# EAGLE board main (EAGLE 5.01), part 1 of 2
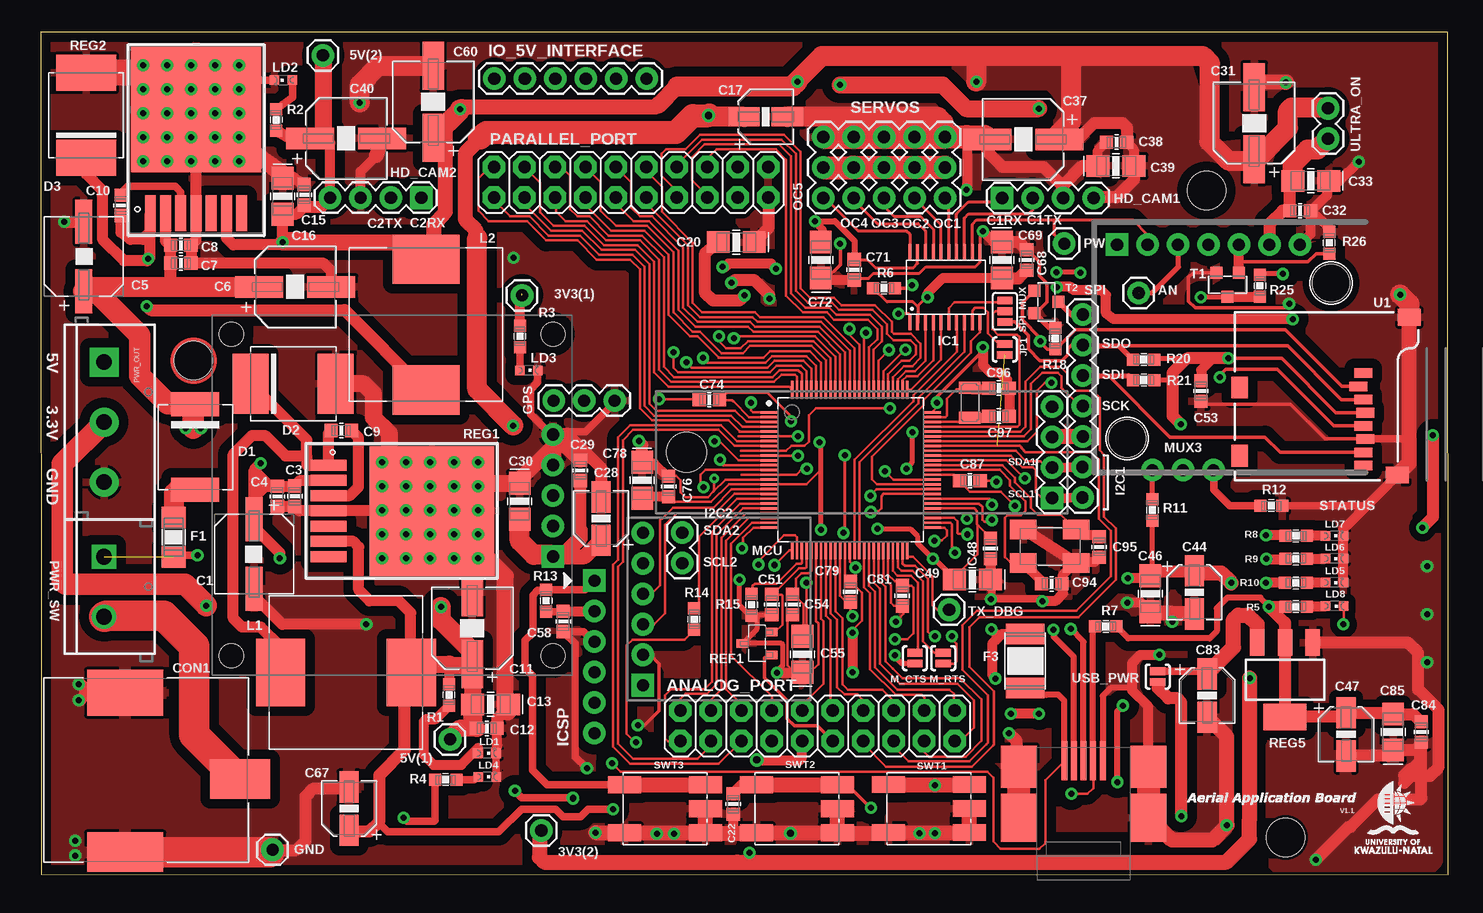
[diagram p2: board, top side]
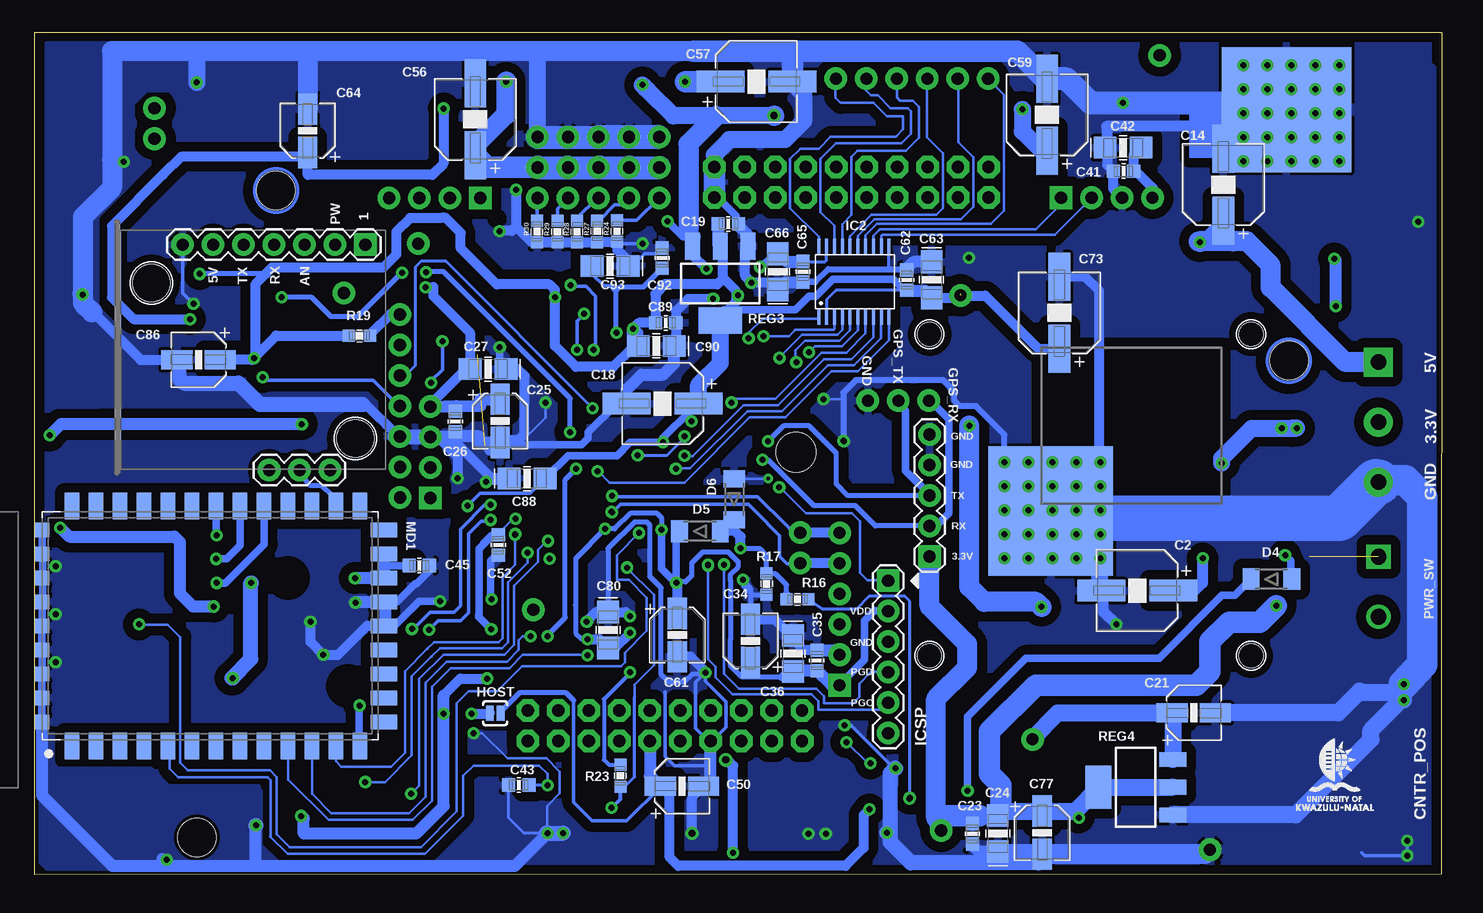
[diagram p3: board, bottom side, seen from below]

Size 117.33 x 70.2 mm. Coordinates in mm from the lower left corner, seen from the top.
Outline: 0.04,0.01 117.33,0 117.29,70.19 0,70.2 0.04,0.01
Copper layers (1*16): Top 0.035mm / dielectric 1.5mm / Bottom 0.035mm
Design rules "SparkFun *": minimum track width 8mil, minimum drill 20mil, track to track 0.2mm, track to pad 0.2mm, pad to pad 0.19mm, via to via 0.2mm, smd to smd 0.2mm, copper to edge 10mil, drill to drill 8mil, minimum pad ring 12mil, minimum via ring 10mil, stop-mask expansion 4mil, vias tented up to drill 25mil, thermal gap 10mil
Holes 3.2 mm at 103.8,3.08 97.19,57.01 12.76,42.83

## Footprints (pad centres in the part's own frame; a part is rotated, then mirrored left to right if it is on the bottom)
1X01 = drill 1.016 pad 1.88: 1 0,0
2X10 = drill 1.016 pad 1.88 octagon: 1 -11.43,-1.27; 2 -11.43,1.27; 3 -8.89,-1.27; 4 -8.89,1.27; 5 -6.35,-1.27; 6 -6.35,1.27; 7 -3.81,-1.27; 8 -3.81,1.27; 9 -1.27,-1.27; 10 -1.27,1.27; 11 1.27,-1.27; 12 1.27,1.27; 13 3.81,-1.27; 14 3.81,1.27; 15 6.35,-1.27; 16 6.35,1.27; 17 8.89,-1.27; 18 8.89,1.27; 19 11.43,-1.27; 20 11.43,1.27
NAZT150M50V6.3X6.3NBF = smd 3.65 x 1.4: + -2.91,-0.06; - 2.89,-0.06
6.3X5.5 = smd 4 x 1.8: + -3,0; - 3,0
0603 = smd 1.1 x 1.1: 1 -0.86,0; 2 0.84,0
EIA3216-18 = smd 1.9 x 1.8: A 1.5,0; C -1.5,0
4X6.3 = smd 2.6 x 1.6: A 1.8,0; C -1.8,0
POWERJACK = smd 5 x 3.3: P$1 -7.85,0.76 | smd 6.35 x 3.81: P$2 1.75,-6.43 | smd 6.35 x 3.3: P$3 1.75,6.86
DO-214AB(SMC) = smd 2 x 4: A 7.11,-3.11; C 0,-3.11
SMC = smd 3 x 5: A -3.5,0; C 3.59,0
MELF-MLL34 = smd 1.4 x 1.8: 1 -1.7,0; 2 1.7,0
3413.0223.22 = smd 1.8 x 2: 1 -1.65,0; 2 1.65,0
MF-MSMF020-2 = smd 1.7 x 3.2: 1 -2.2,0; 2 2.3,0
1X03 = drill 1.016 pad 1.88: 1 0,0; 2 2.54,0; 3 5.08,0
SENSOR_STICK = drill 1.016 pad 1.88 square: 1 -16.51,3.81 | drill 1.016 pad 1.88: 2 -16.51,1.27; 3 -16.51,-1.27; 4 -16.51,-3.81 | hole 3.302: 13.97,0
LS20031 = drill 1.016 pad 1.88 square: 1 9.885,1.6 | drill 1.016 pad 1.88: 2 12.425,1.6; 3 14.965,1.6; 4 17.505,1.6; 5 20.045,1.6 | hole 2: 1.6,28.4; 28.4,28.4; 28.4,1.6; 1.6,1.6
EZ3 = drill 1.016 pad 1.88 square: 1 20.4,1.2 | drill 1.016 pad 1.88: 2 17.86,1.2; 3 15.32,1.2; 4 12.78,1.2; 5 10.24,1.2; 6 7.7,1.2; 7 5.16,1.2 | hole 3.1: 19.56,17.36; 2.56,4.4
BAROMETER = drill 1.016 pad 1.88 square: 1 -6.35,6.35 | drill 1.016 pad 1.88: 2 -3.81,6.35; 3 -1.27,6.35; 4 1.27,6.35; 5 3.81,6.35; 6 6.35,6.35
1X04 = drill 1.016 pad 1.88 square: 1 0,0 | drill 1.016 pad 1.88: 2 2.54,0; 3 5.08,0; 4 7.62,0
SJ_2S-NO = smd 0.635 x 1.27: 1 -0.45,0; 2 0.45,0
1X02 = drill 1.016 pad 1.88: 1 0,0; 2 2.54,0
U20-3 = smd 0.25 x 1.27: 1 -3.025,-3.1; 2 -2.375,-3.1; 3 -1.725,-3.1; 4 -1.075,-3.1; 5 -0.425,-3.1; 6 0.225,-3.1; 7 0.875,-3.1; 8 1.525,-3.1; 9 2.175,-3.1; 10 2.825,-3.1; 11 2.825,2.805; 12 2.175,2.805; 13 1.525,2.805; 14 0.875,2.805; 15 0.225,2.805; 16 -0.425,2.805; 17 -1.075,2.805; 18 -1.725,2.805; 19 -2.375,2.805; 20 -3.025,2.805
1X06 = drill 1.016 pad 1.88: 1 0,0; 2 2.54,0; 3 5.08,0; 4 7.62,0; 5 10.16,0; 6 12.7,0
12X12MM_PACK = smd 4.1 x 5.6: 1 -5.45,0; 2 5.45,0
CHIPLED_0603 = smd 0.8 x 0.8: A 0,-0.75; C 0,0.75
TQFP100_12MM = smd 1.5 x 0.2: 1 0,0; 2 0,-0.4; 3 0,-0.8; 4 0,-1.2; 5 0,-1.6; 6 0,-2; 7 0,-2.4; 8 0,-2.8; 9 0,-3.2; 10 0,-3.6; 11 0,-4; 12 0,-4.4; 13 0,-4.8; 14 0,-5.2; 15 0,-5.6; 16 0,-6; 17 0,-6.4; 18 0,-6.8; 19 0,-7.2; 20 0,-7.6; 21 0,-8; 22 0,-8.4; 23 0,-8.8; 24 0,-9.2; 25 0,-9.6; 51 13.55,-9.6; 52 13.55,-9.2; 53 13.55,-8.8; 54 13.55,-8.4; 55 13.55,-8; 56 13.55,-7.6; 57 13.55,-7.2; 58 13.55,-6.8; 59 13.55,-6.4; 60 13.55,-6; 61 13.55,-5.6; 62 13.55,-5.2; 63 13.55,-4.8; 64 13.55,-4.4; 65 13.55,-4; 66 13.55,-3.6; 67 13.55,-3.2; 68 13.55,-2.8; 69 13.55,-2.4; 70 13.55,-2; 71 13.55,-1.6; 72 13.55,-1.2; 73 13.55,-0.8; 74 13.55,-0.4; 75 13.55,0 | smd 0.2 x 1.5: 26 1.9,-11.5; 27 2.3,-11.5; 28 2.7,-11.5; 29 3.1,-11.5; 30 3.5,-11.5; 31 3.9,-11.5; 32 4.3,-11.5; 33 4.7,-11.5; 34 5.1,-11.5; 35 5.5,-11.5; 36 5.9,-11.5; 37 6.3,-11.5; 38 6.7,-11.5; 39 7.1,-11.5; 40 7.5,-11.5; 41 7.9,-11.5; 42 8.3,-11.5; 43 8.7,-11.5; 44 9.1,-11.5; 45 9.5,-11.5; 46 9.9,-11.5; 47 10.3,-11.5; 48 10.7,-11.5; 49 11.1,-11.5; 50 11.5,-11.5; 76 11.5,1.9; 77 11.1,1.9; 78 10.7,1.9; 79 10.3,1.9; 80 9.9,1.9; 81 9.5,1.9; 82 9.1,1.9; 83 8.7,1.9; 84 8.3,1.9; 85 7.9,1.9; 86 7.5,1.9; 87 7.1,1.9; 88 6.7,1.9; 89 6.3,1.9; 90 5.9,1.9; 91 5.5,1.9; 92 5.1,1.9; 93 4.7,1.9; 94 4.3,1.9; 95 3.9,1.9; 96 3.5,1.9; 97 3.1,1.9; 98 2.7,1.9; 99 2.3,1.9; 100 1.9,1.9
WIFIFLY2 = smd 2.2 x 1.2: 1 -2,25.5; 2 -2,23.5; 3 -2,21.5; 4 -2,19.5; 5 -2,17.5; 6 -2,15.5; 7 -2,13.5; 8 -2,11.5; 9 -2,9.5; 10 -2,7.5; 11 -2,5.5; 12 -2,3.5; 13 -2,1.5; 23 18,1.5; 24 18,3.5; 25 18,5.5; 26 18,7.5; 27 18,9.5; 28 18,11.5; 29 18,13.5; 30 18,15.5; 31 18,17.5; 32 18,19.5; 33 18,21.5; 34 18,23.5; 35 18,25.5 | smd 1.2 x 2.2: 14 0,-0.5; 15 2,-0.5; 16 4,-0.5; 17 6,-0.5; 18 8,-0.5; 19 10,-0.5; 20 12,-0.5; 21 14,-0.5; 22 16,-0.5 | smd 1.2 x 1.2: 36 16,28; 37 14,28; 38 12,28; 39 10,28; 40 8,28; 41 6,28; 42 4,28; 43 2,28; 44 0,28
SCREWTERMINAL-5MM-3 = drill 1.3 pad 2.413 square: 1 0,0 | drill 1.3 pad 2.413: 2 5,0; 3 10,0
SCREWTERMINAL-5MM-2 = drill 1.3 pad 2.032 square: 1 0,0 | drill 1.3 pad 2.032: 2 5,0
0603' = smd 1 x 1: 1 -0.9,0; 2 0.9,0
SOT-23-3 = smd 0.7 x 1: 1 -0.95,-1.9; 2 0.95,-1.9; 3 0,0.5
TO-263 = smd 3 x 0.91: 1 8.62,-3.81; 2 8.62,-2.54; 3 8.62,-1.27; 4 8.62,0; 5 8.62,1.27; 6 8.62,2.54; 7 8.62,3.81 | smd 10.41 x 10.8: 8 0,0 | smd 10.41 x 10.8 bottom: 9 0,0
SOT223 = smd 1.219 x 2.235: 1 -2.311,-3.099; 2 0,-3.099; 3 2.311,-3.099 | smd 3.6 x 2.2: 4 0,3.099
SERVO_HEADER = drill 1.016 pad 1.88: 1 -2.54,0; 2 0,0; 3 2.54,0; 4 -2.54,-2.54; 5 0,-2.54; 6 2.54,-2.54; 7 -2.54,-5.08; 8 0,-5.08; 9 2.54,-5.08; 10 -2.54,-7.62; 11 0,-7.62; 12 2.54,-7.62; 13 -2.54,-10.16; 14 0,-10.16; 15 2.54,-10.16
1X05 = drill 1.016 pad 1.88: 1 0,0; 2 2.54,0; 3 5.08,0; 4 7.62,0; 5 10.16,0
SJ_3 = smd 0.635 x 1.27: 1 -0.889,0; 2 0,0; 3 0.889,0
TACT = smd 2.75 x 1.4: 1 3.375,-2; 2 -3.375,-2; 3 3.375,2; 4 -3.375,2; 5 3.375,0
MOSFET = smd 1 x 1: 1 0.95,2; 2 -0.95,2; 3 0,0
MICRO-SD-SOCKET-PP = smd 0.8 x 1.5: 1 -8.94,10.7; 2 -7.84,10.3; 3 -6.74,10.7; 4 -5.64,10.9; 5 -4.54,10.7; 6 -3.44,10.9; 7 -2.34,10.7; 8 -1.24,10.7 | smd 1.8 x 1.4: CD1 -2.05,0.4; CD2 -7.75,0.4 | smd 1.4 x 1.9: GND1 -13.6,14.55; GND3 -0.45,13.55
ICSP = drill 1.016 pad 1.88 square: 1 -6.35,0 | drill 1.016 pad 1.88: 2 -3.81,0; 3 -1.27,0; 4 1.27,0; 5 3.81,0; 6 6.35,0
USBMINIB2 = smd 3.25 x 0.5: D+ 7.95,0; D- 7.95,0.8; GND 7.95,-1.6; ID 7.95,-0.8; VBUS 7.95,1.6 | smd 4 x 3: GND@1 3.2,-5.4; GND@3 3.2,5.4 | smd 3.5 x 3: GND@2 7.45,-5.4; GND@4 7.45,5.4
1.5X3.2MM_SMD_RTCC = smd 1 x 1.8: 1 0,0; 2 2.5,0
3.2X5MM_SMD_CRYSTAL = smd 2.2 x 1.6: 1 -0.2,-0.2; 2 4.2,-0.2; 3 4.2,2.6; 4 -0.2,2.6

## Placement (x,y rotation side)
3V3(1)  M01PTH  [1X01]  40.14,48.27 0 top
3V3(2)  M01PTH  [1X01]  41.74,3.67 0 top
5V(1)  M01PTH  [1X01]  34.14,11.27 0 top
5V(2)  M01PTH  [1X01]  23.54,68.27 0 top
AN  M01PTH  [1X01]  91.54,48.47 0 top
ANALOG_PORT  M10X2  [2X10]  64.77,12.4 0 top
C1  15uF50V  [NAZT150M50V6.3X6.3NBF]  17.87,26.7 270 top
C2  15uF50V  [6.3X5.5]  25.4,23.66 180 bottom
C3  220nF25V  [0603]  21.19,31.52 270 top
C4  220nF25V  [0603]  19.74,31.51 270 top
C5  15uF50V  [NAZT150M50V6.3X6.3NBF]  3.54,51.51 90 top
C6  15uF50V  [6.3X5.5]  21.23,48.97 0 top
C7  220nF25V  [0603]  11.7,50.96 0 top
C8  220nF25V  [0603]  11.7,52.44 0 top
C9  10nF50V  [0603]  25.06,37 180 top
C10  10nF50V  [0603]  6.72,55.76 270 top
C11  100uF16V  [6.3X5.5]  35.98,20.53 90 top
C12  100nF16V  [0603]  37.21,12.19 0 top
C13  10uF16V  [EIA3216-18]  37.52,14.19 0 top
C14  100uF16V  [6.3X5.5]  18.23,57.5 90 bottom
C15  100nF16V  [0603]  21.98,56.66 90 top
C16  10uF16V  [EIA3216-18]  20.18,56.53 90 top
C17  22uF10V  [4X6.3]  60.45,63.15 0 top
C18  100uF16V  [6.3X5.5]  64.96,39.25 180 bottom
C19  100nF16V  [0603]  59.48,54.23 0 bottom
C20  10uF6.3V  [EIA3216-18]  57.99,52.7 0 top
C21  22uF10V  [4X6.3]  20.69,13.48 0 bottom
C22  100nF16V  [0603]  57.75,5.87 270 top
C23  100nF16V  [0603]  39.14,3.39 270 bottom
C24  10uF6.3V  [EIA3216-18]  37.03,3.42 270 bottom
C25  22uF10V  [4X6.3]  78.52,37.8 270 bottom
C26  100nF16V  [0603]  82.24,37.75 270 bottom
C27  10uF16V  [EIA3216-18]  79.52,42.13 0 bottom
C28  22uF6.3V  [4X6.3]  46.73,29.67 90 top
C29  100nF16V  [0603]  45,33.7 90 top
C30  10uF6.3V  [EIA3216-18]  39.94,31.11 90 top
C31  100uF16V  [6.3X5.5]  101.17,62.62 90 top
C32  100nF16V  [0603]  105,55.32 0 top
C33  10uF16V  [EIA3216-18]  105.88,57.81 0 top
C34  22uF6.3V  [4X6.3]  57.65,19.47 90 bottom
C35  100nF16V  [0603]  52.11,17.85 90 bottom
C36  10uF6.3V  [EIA3216-18]  54.1,18.42 90 bottom
C37  100uF16V  [6.3X5.5]  81.92,61.27 180 top
C38  100nF16V  [0603]  89.68,61.04 180 top
C39  10uF16V  [EIA3216-18]  89.65,59.05 180 top
C40  100uF16V  [6.3X5.5]  25.48,61.35 0 top
C41  100nF16V  [0603]  26.56,58.62 180 bottom
C42  10uF16V  [EIA3216-18]  26.58,60.58 180 bottom
C43  100nF16V  [0603]  76.97,7.46 180 bottom
C44  22uF6.3V  [4X6.3]  96.18,23.52 270 top
C45  100nF16V  [0603]  85.25,25.75 0 bottom
C46  10uF6.3V  [EIA3216-18]  92.51,23.4 270 top
C47  22uF6.3V  [4X6.3]  108.82,11.69 270 top
C48  100nF16V  [0603]  79.18,27.17 270 top
C49  10uF6.3V  [EIA3216-18]  77.69,24.59 0 top
C50  22uF10V  [4X6.3]  63.36,7.37 0 bottom
C51  100nF16V  [0603]  60.96,22.49 270 top
C52  100nF16V  [0603]  78.67,27.45 270 bottom
C53  100nF16V  [0603]  96.72,40.29 270 top
C54  100nF16V  [0603]  62.69,22.49 270 top
C55  10uF6.3V  [EIA3216-18]  63.52,18.37 270 top
C56  100uF16V  [6.3X5.5]  80.59,62.94 90 bottom
C57  100uF16V  [6.3X5.5]  57.15,66.08 0 bottom
C58  100nF16V  [0603]  43.57,21.09 270 top
C59  100uF16V  [6.3X5.5]  32.93,63.31 90 bottom
C60  100uF16V  [6.3X5.5]  32.74,64.39 90 top
C61  22uF6.3V  [4X6.3]  63.75,19.96 270 bottom
C62  100nF16V  [0603]  44.63,49.55 90 bottom
C63  10uF6.3V  [EIA3216-18]  42.54,49.56 90 bottom
C64  22uF10V  [4X6.3]  94.55,61.98 90 bottom
C65  100nF16V  [0603]  53.27,50.23 270 bottom
C66  10uF16V  [EIA3216-18]  55.38,50.24 270 bottom
C67  22uF10V  [4X6.3]  25.73,5.5 90 top
C68  100nF16V  [0603]  82.2,51.23 90 top
C69  10uF6.3V  [EIA3216-18]  80.14,51.22 90 top
C71  100nF16V  [0603]  67.83,50.39 270 top
C72  10uF16V  [EIA3216-18]  65.05,51.21 270 top
C73  100uF16V  [6.3X5.5]  31.89,46.81 90 bottom
C74  100nF16V  [0603]  55.75,39.57 180 top
C76  100nF16V  [0603]  52.36,32.35 90 top
C77  22uF6.3V  [4X6.3]  33.32,3.5 270 bottom
C78  10uF6.3V  [EIA3216-18]  50.15,32.85 90 top
C79  100nF16V  [0603]  67.52,23.56 270 top
C80  10uF6.3V  [EIA3216-18]  69.52,20.39 90 bottom
C81  100nF16V  [0603]  71.84,23.23 270 top
C83  22uF10V  [4X6.3]  97.24,14.92 270 top
C84  100nF16V  [0603]  115.1,11.88 270 top
C85  10uF6.3V  [EIA3216-18]  112.75,11.88 270 top
C86  22uF6.3V  [4X6.3]  103.65,42.9 180 bottom
C87  100nF16V  [0603]  77.48,32.82 0 top
C88  10uF6.3V  [EIA3216-18]  76.28,33 180 bottom
C89  100nF16V  [0603]  64.71,45.98 0 bottom
C90  10uF6.3V  [EIA3216-18]  65.5,44.05 0 bottom
C92  100nF16V  [0603]  65.02,51.38 90 bottom
C93  10uF6.3V  [EIA3216-18]  69.34,50.71 0 bottom
C94  18pF  [0603]  84.29,24.23 0 top
C95  18pF  [0603]  88.25,27.31 90 top
C96  8.2pF  [0603]  79.9,40.54 0 top
C97  8.2pF  [0603]  79.9,38.2 0 top
CON1  POWERJACK  [POWERJACK]  8.8,8.73 180 top
D1  SSC54-E3/57T  [DO-214AB(SMC)]  9.8,32.07 90 top
D2  B360  [SMC]  21.02,40.9 0 top
D3  B360  [SMC]  3.8,63.22 90 top
D4  FDLL4148X  [MELF-MLL34]  14.22,24.62 0 bottom
D5  FDLL4148X  [MELF-MLL34]  61.86,28.61 0 bottom
D6  FDLL4148X  [MELF-MLL34]  59,31.28 90 bottom
F1  FUSE_MAIN  [3413.0223.22]  11.1,28.11 90 top
F3  FUSE  [MF-MSMF020-2]  82.08,17.75 90 top
GND  M01PTH  [1X01]  19.34,2.07 0 top
GPS  [1X03]  42.78,39.49 0 top
HD1  9DOF_SENSORSTICK  [SENSOR_STICK]  67.82,35.19 180 top
HD2  LS20031  [LS20031]  44.32,16.63 90 top
HD3  EZ3  [EZ3]  110.14,53.69 180 top
HD4  BMP085  [BAROMETER]  56.57,22.13 90 top
HD_CAM1  [1X04]  80.16,56.38 0 top
HD_CAM2  [1X04]  31.75,56.41 180 top
HOST  [SJ_2S-NO]  78.93,13.45 180 bottom
I2C1  [1X02]  86.86,31.43 90 top
I2C2  [1X02]  53.49,28.49 270 top
IC1  MAX3002-2  [U20-3]  75.49,49.09 0 top
IC2  MAX3002-2  [U20-3]  48.92,49.54 0 bottom
IO_5V_INTERFACE  [1X06]  50.53,66.33 180 top
JP1  [SJ_2S-NO]  80.38,43.76 270 top
L1  B82477G  [12X12MM_PACK]  25.46,16.84 0 top
L2  B82477G  [12X12MM_PACK]  32.13,45.83 90 top
LD1  5V_1  [CHIPLED_0603]  37.23,10.11 270 top
LD2  5V_2  [CHIPLED_0603]  20.26,66.2 90 top
LD3  3V3_1  [CHIPLED_0603]  40.7,42.02 270 top
LD4  3V3_2  [CHIPLED_0603]  37.24,8.14 270 top
LD5  ASSOC.  [CHIPLED_0603]  107.86,24.33 270 top
LD6  DATA TX  [CHIPLED_0603]  107.86,26.33 270 top
LD7  CONNECT  [CHIPLED_0603]  107.86,28.23 270 top
LD8  BOOT  [CHIPLED_0603]  107.87,22.38 270 top
M_CTS  [SJ_2S-NO]  72.89,18.04 90 top
M_RTS  [SJ_2S-NO]  75.25,18.04 270 top
MCU  PIC32MX795F512L  [TQFP100_12MM]  60.76,38.52 0 top
MD1  WIFLY2  [WIFIFLY2]  88.69,12.73 90 bottom
MUX3  [1X03]  92.69,33.7 180 bottom
PARALLEL_PORT  M10X2  [2X10]  49.23,57.69 0 top
PW  M01PTH  [1X01]  85.34,52.58 0 top
PWR_OUT  [SCREWTERMINAL-5MM-3]  5.3,42.71 270 top
PWR_SW  [SCREWTERMINAL-5MM-2]  5.3,26.49 270 top
R1  470R  [0603']  34.06,14.97 90 top
R2  470R  [0603']  19.63,62.89 270 top
R3  220R  [0603']  39.97,44.85 90 top
R4  220R  [0603']  33.78,7.89 180 top
R5  220R  [0603']  104.65,22.33 180 top
R6  10k  [0603']  70.31,48.88 180 top
R7  10k  [0603']  88.79,20.68 0 top
R8  220R  [0603']  104.66,28.23 0 top
R9  220R  [0603']  104.65,26.33 0 top
R10  220R  [0603']  104.64,24.33 0 top
R11  10k  [0603']  92.68,30.38 270 top
R12  10k  [0603']  102.6,30.73 180 top
R13  10k  [0603']  42.14,22.82 270 top
R14  10k  [0603']  54.49,21.29 90 top
R15  RES0603  [0603']  59.27,22.49 270 top
R16  1M  [0603']  53.73,22.94 0 bottom
R17  180k  [0603']  56.3,24.22 270 bottom
R18  10k  [0603']  84.58,44.68 90 top
R19  10k  [0603']  90.24,44.91 0 bottom
R20  10k  [0603']  91.96,42.92 180 top
R21  10k  [0603']  91.96,41.21 180 top
R23  10k  [0603']  68.49,8.24 90 bottom
R24  10k  [0603']  68.77,53.62 90 bottom
R25  10k  [0603']  101.65,49.07 270 top
R26  10k  [0603']  107.43,52.66 90 top
R27  10k  [0603']  70.42,53.6 90 bottom
R28  10k  [0603']  72.09,53.58 90 bottom
R29  10k  [0603']  73.74,53.58 90 bottom
R30  10k  [0603']  75.44,53.59 90 bottom
REF1  REF3133AIDBZTG4  [SOT-23-3]  59.02,19.26 90 top
REG1  LM2676  [TO-263]  32.62,30.31 180 top
REG2  LM2676  [TO-263]  12.97,63.73 270 top
REG3  LM1117IDT3.3  [SOT223]  60.16,49.26 180 bottom
REG4  LM1117IDT3.3  [SOT223]  25.55,7.28 90 bottom
REG5  LM1117IDT3.3  [SOT223]  103.73,16.24 180 top
SERVOS  RX_SERVO_STACK  [SERVO_HEADER]  65.24,58.92 90 top
SPI  [1X05]  86.88,46.67 270 top
SPI_MUX  [SJ_3]  80.39,46.95 270 top
SWT1  RESET_WIFI  [TACT]  74.05,5.5 0 top
SWT2  PROGRAM  [TACT]  63.05,5.48 0 top
SWT3  RESET_MCU  [TACT]  52.05,5.49 0 top
T1  2N7002  [MOSFET]  98.95,48.15 0 top
T2  2N7002  [MOSFET]  84.84,47.72 90 top
TX_DBG  M01PTH  [1X01]  75.74,22.07 0 top
U1  MICROSD  [MICRO-SD-SOCKET-PP]  99.55,32.85 270 top
U$46  ICSP  [ICSP]  46.17,18.14 270 bottom
U$47  USBMINIB2  [USBMINIB2]  86.94,1.56 90 top
ULTRA_ON  [1X02]  107.33,61.32 90 top
USB_PWR  [SJ_2S-NO]  93.12,16.5 90 top
X2  32.786kHz  [1.5X3.2MM_SMD_RTCC]  77.46,40.57 270 top
X3  8MHz  [3.2X5MM_SMD_CRYSTAL]  82.12,26.16 0 top

## Tracks (layer width: path | path; a pad name or v marks a point on that pad's centre or on a via)
3.3V_(1)  (via drill 0.5)  (1 unrouted)
  Top 0.2: v67.45,45.46 v67.44,45.47 67.44,45.41 67.22,45.19 68.26,44.15 MCU.86 | C54.1 62.71,23.37 62.75,23.37 63.58,22.54 63.58,19.88 C55.C 63.52,19.96 63.83,20.27 v63.83,24.32 | MCU.37 67.06,24.88 C79.1 | C79.1 67.56,24.38 | v67.68,20.17 67.68,20.35 68.49,21.16 68.49,23.48 67.54,24.43 C79.1 | MCU.46 70.66,24.99 71.21,24.44 71.47,24.44 71.82,24.09 C81.1 71.84,24.01 71.85,24 71.92,24.07 72.59,24.07 72.77,23.89 72.77,21.45 | 72.77,21.45 72.77,21.42 | MCU.62 76.16,33.32 76.62,32.86 C87.1 76.62,32.75 77.46,31.91 80.06,31.91 v81.24,30.73 v81.24,30.72 | MCU.55 77.83,30.52 78.07,30.28 78.07,29.2 78.11,29.17 | C48.1 79.2,28.03 79.22,28.05 78.11,29.17 | 76.19,24.65 C49.C 76.25,24.65 76.27,24.65 76.27,24.86 78.09,26.69 78.09,28.99 78.18,29.08 78.1,29.16 78.11,29.17 | C54.1 62.69,23.33 62.67,23.31 | MCU.30 64.26,25.32 64.06,25.12 63.43,25.12 62.96,24.65 62.96,23.45 62.86,23.35 C54.1 | 52.39,31.44 52.36,31.47 C76.1 52.36,31.45 52.76,31.05 55.91,31.05 57.38,32.52 MCU.16 63.84,32.52 64.92,33.6 v64.93,36.04 | 52.39,31.44 52.42,31.47 | 50.48,31.31 50.47,31.3 | C78.C 50.48,31.31 | 50.48,31.31 50.66,31.49 | v71.24,19.62 v71.24,19.63 72.29,19.63 72.77,20.11 72.77,21.45 | 52.39,31.44 52.45,31.38 | MCU.2 59.07,38.12 57.76,39.43 57.76,39.45 57.74,39.45 57.65,39.54 56.58,39.54 | 56.58,39.54 56.54,39.54 | C74.1 56.58,39.54 | 62.61,37.8 62.6,37.79 v62.57,37.79
  Top 0.254: 73.95,48.17 73.89,48.17 73.12,47.4 73.12,47.31 | 73.12,45.97 73.11,45.96 | 73.12,45.97 IC1.2 | 73.12,47.31 73.12,45.97 | R6.2 70.57,47.72 72.72,47.72 73.13,47.31 73.12,47.31 | C74.1 56.61,39.6 56.56,39.65 57.18,40.17 60.59,40.17 62.61,38.15 62.61,37.8
  Top 0.305: 98.58,43.01 98.9,43.01 103.46,43.01 107.98,38.49 U1.4
  Top 0.406: U1.4 110.5,38.49 110.51,38.5 110.52,38.49 | 64.91,36.04 64.9,36.05 | 64.91,36.04 v64.93,36.04 | v65.06,28.73 65.06,35.89 64.91,36.04 | v69.77,28.8 72.5,28.8 73.09,28.22 73.09,27.63 v74.38,26.33 74.37,26.32 | 74.37,26.32 74.34,26.32 | 76.19,24.65 74.52,26.32 74.37,26.32 | v99.02,43.02 98.98,42.98 92.92,42.98 R20.1 | 94.37,41.19 94.35,41.19 92.88,41.19 R21.1 | R25.1 101.77,49.85 101.97,50.05 v103.56,50.05
  Top 0.5: 76.56,24.45 76.42,24.59 C49.C | R7.2 90.68,19.69 97.47,19.69 98.04,20.26 98.04,22.19 98.94,23.09 101.7,23.09 102.43,22.36 102.41,22.34 v102.38,22.34
  Top 0.61: 43.6,21.92 C58.1 | R13.2 43.6,21.92 | 43.6,21.92 43.61,21.91
  Top 0.813: v67.67,20.17 67.65,20.19 | v67.68,20.17 v67.67,20.17 | v67.7,16.86 67.7,20.14 v67.67,20.17 | v73.95,48.12 73.95,48.17 | v73.95,48.12 73.95,48.44 75.23,49.72 C69.C | v73.95,48.12 v73.95,48.11 | 98.9,43.01 98.9,43.03 99.01,43.03 v99.02,43.02 98.99,43.05 97.76,43.05 96.76,42.05 96.76,41.19 C53.1 | R3.2 39.97,48.25 40.12,48.4 | 46.21,21.95 U$46.2 C58.1 | C78.C 50.15,31.44 50.2,31.49 C76.1
  Top 1.016: C69.C 80.17,49.69 81.52,49.69 C68.1 | REG5.4 103.73,13.12 | REG5.4 REG5.2 103.73,21.02 103.68,21.02 v102.37,22.33 v102.38,22.34 v102.39,22.33 R5.2 | 103.57,13.17 103.6,13.14 REG5.4 | C20.C 55.4,51.78 55.4,48.43 56.07,47.83 58.26,47.83 v58.69,48.26 | v115.2,28.9 116.06,29.79 v116.06,36.61 | v95.04,37.54 94.35,38.23 94.35,41.19 94.35,41.8 95.57,43.02 v99.02,43.02 | v99.02,43.02 99.06,43.02 | v99.02,43.02 | 103.68,13.19 108.57,13.19 108.82,13.44 C47.C 112.56,13.49 112.67,13.38 C85.C 114.43,13.38 115.07,12.74 C84.1
  Top 1.422: 103.46,13.19 103.68,13.19 REG5.4
  Bottom 0.2: v64.93,36.04 64.92,35.96 | 62.61,38.72 62.78,38.89 62.78,38 v62.57,37.79
  Bottom 0.254: IC2.2 51.3,47.91 50.51,48.69 C62.1 44.58,48.64 | R23.2 68.49,9.25
  Bottom 0.305: 81.27,30.72 v81.24,30.72 v81.23,30.72 80.18,31.77 76.01,31.77 C88.C 74.8,33 | 61.88,39.25 61.84,39.29 | 61.88,39.25 C18.+ | 62.36,39.1 62.03,39.1 61.88,39.25 | 74.8,33 74.81,32.99 | 74.73,33.07 74.8,33
  Bottom 0.35: v67.7,16.86 67.7,16.79 69.86,14.63 69.86,9.57 69.43,9.14 68.6,9.14 68.53,9.07 68.49,9.11 R23.2
  Bottom 0.406: 59.29,19.61 59.29,24.44 | 59.29,24.44 59.29,24.47 | v63.83,24.32 63.75,24.4 63.05,24.4 62.55,24.89 62.55,25.95 61.62,26.88 59.5,26.88 58.7,26.08 58.67,26.08 58.66,26.07 58.66,25.66 59.29,25.03 59.29,24.46 59.27,24.44 59.29,24.44 | 72.22,22.41 72.22,20.13 71.73,19.64 71.22,19.64 71.22,19.63 v71.24,19.62 | 72.22,22.41 72.22,22.52 | v65.06,28.73 65.02,28.77 65.02,29.69 65.44,30.11 67.65,30.11 68.96,28.8 v69.77,28.8 69.76,28.8 | 55.07,16.45 57.78,16.45 | 57.78,16.45 58.34,16.45 59.29,17.4 59.29,19.61 | 59.29,19.61 59.29,19.6 | C34.C 57.67,17.67 57.69,17.65 57.69,16.57 57.78,16.48 57.78,16.45 | 69.76,28.8 69.74,28.82 | 72.22,22.41 72.22,26.34 69.76,28.8 | 98.02,50.11 97.96,50.05 v103.56,50.05
  Bottom 0.61: C90.C 66.96,44.01 | 62.36,39.1 62.36,38.96 62.61,38.72 64.96,36.36 64.96,36.05 v64.94,36.05 v64.93,36.04 | D5.1 63.85,28.32 63.85,24.32 | 60.41,46.55 59.88,47.08 53.88,47.08 52.79,48.18 52.19,48.18 50.75,49.61 45.75,49.61 44.71,48.58 44.63,48.66 C62.1 | HD4.1 50.22,15.81 48.15,17.89 48.15,21.17 47.34,21.97 46.19,21.97 U$46.2 | v64.93,36.04 v64.93,36.03 | v64.93,36.04 64.92,36.05 | 63.83,24.25 63.82,24.23 | v63.83,24.32 63.83,24.25 | v65.06,28.73 65.06,25.47 63.83,24.25 | C36.C 54.58,16.94 55.07,16.45 | 74.73,33.07 72.84,34.9 68.76,34.9 67.69,36.03 v64.92,36.03 v64.93,36.04
  Bottom 0.813: v67.68,20.17 67.68,20.13 68.92,18.89 C80.C 70.25,19.62 v71.24,19.62 | C90.C 67,45.16 67.42,45.58 67.44,45.56 v67.44,45.47 67.48,45.47 | 67.48,45.47 67.51,45.44 | 66.97,45.98 C89.1 65.56,48.38 64.86,49.19 60.42,49.19 59.87,49.64 | 66.97,45.98 67.48,45.47 | 52.15,17.02 52.14,17.02 C35.1 | 54.36,16.76 C36.C | REG3.4 60.16,46.42 60.17,46.43 58.83,47.76 58.83,48.3 | 66.97,45.98 67.55,45.4 67.55,43.83 69.08,42.3 72.19,42.3 73.95,44.06 73.95,48.1 | 73.95,48.74 v73.95,48.12 73.95,48.1 | 73.95,48.1 73.95,48.74 | 99.02,43 99.04,42.98 | 99.02,43 v99.02,43.02 | 99.02,43 98.93,43.09 98.93,49.19 98.02,50.11 97.54,50.58 88.28,50.58 87.18,51.67 87.18,53.38 87.17,53.38 87.17,53.56 86.02,54.71 83.44,54.71 83.44,54.73 83.06,54.73 81.8,53.47 81.8,52.18 78.81,49.19 74.4,49.19 73.95,48.74 | v63.83,24.32 63.85,24.32 63.86,24.31 63.75,24.2 C61.C | v99.02,43.02 99.02,43.07 99.03,43.08 99.21,42.9 C86.C | C73.+ 33.63,43.81 38.07,48.25 40.16,48.25 | v99.02,43.02 99.02,43.09 97.2,44.91 R19.1 | 58.83,48.3 58.83,48.6 59.87,49.64 | REG3.2 60.03,52.22 59.95,52.22 59.95,49.72 59.87,49.64 | v58.69,48.26 58.73,48.3 58.83,48.3 | 59.87,49.64 59.86,49.64 | 40.16,48.25 3V3(1).1 | C63.C 40.36,48.05 40.16,48.25
  Bottom 1.016: 67.43,45.51 v67.43,45.48 v67.44,45.47 | C62.1 44.63,48.67 43.15,48.67 C63.C | C19.1 60.33,52.53 REG3.2 | v115.2,28.9 114.43,28.16 105.66,28.16 105.22,27.72 105.22,23.45 104.13,22.36 102.4,22.36 v102.38,22.34 v102.37,22.33 | v116.06,36.61 115.13,37.54 v95.04,37.54 | C35.1 52.09,16.98 50.91,15.8 50.2,15.8 | C35.1 | 54.36,16.76 54.14,16.98 C35.1 | 50.2,15.8 50.17,15.8 | HD4.1 50.2,15.8
  Bottom 1.27: 60.41,46.55 60.56,46.4 | REG3.4 60.41,46.55 | 60.41,46.55 60.4,46.56
  Bottom 1.422: C18.+ 61.96,40.82 60.16,42.62 60.16,46.05 60.2,46.09 60.16,46.13 REG3.4
3.3V_(2)  (via drill 0.5, 0.6 pad 0.25)
  Top 0.406: 90.64,24.68 v90.62,24.7 v90.62,24.71 | C46.C 92.62,24.79 92.7,24.79 92.7,29.46 R11.2
  Top 0.61: R4.2 32.88,4.54 32.79,4.45 30.57,4.45 v30.28,4.75
  Top 0.813: 90.57,24.71 v90.62,24.71 92.32,24.71 C46.C | ANALOG_PORT.9 63.5,10.96 63.43,10.89 63.47,10.85 63.47,9.71 63.27,9.51 59.68,9.51 59.68,9.54 v59.7,9.56 | 59.1,1.04 59.1,1.05 | 59.1,1.05 59.11,1.04 | 58.07,1.04 58.07,1.06 58.09,1.04 59.12,1.04 | 59.1,1.05 v59.1,1.81
  Top 1.016: 42.78,26.47 42.73,26.51 HD2.1 | 45,28.69 C29.1 | C44.C 96.1,25.24 92.85,25.24 92.74,25.13
  Top 1.27: 39.94,28.78 C30.C | 42.77,26.5 42.76,26.51 HD2.1 | HD2.1 42.73,26.5 | C28.C 45.36,26.5 43.51,26.5 | C44.C 96.19,25.13 98.43,25.13 v99.26,24.3 | 92.74,25.13 C46.C | 59.1,1.04 58.07,1.04 41.99,1.04 41.59,1.44 41.59,3.48 41.76,3.65 3V3(2).1 | v100.79,16.38 100.79,4.65 100.8,4.64 100.78,4.62 100.78,2.96 98.86,1.04 59.12,1.04 | 42.72,26.55 42.69,26.58 | HD2.1 42.72,26.55 | 42.77,26.5 43.51,26.5 | 42.72,26.55 42.77,26.5 | 43.51,26.5 43.51,26.57 45,28.06 45,28.69
  Top 1.676: 39.94,28.78 39.94,27.81 41.1,26.65 42.65,26.65 42.79,26.51 | 42.79,26.51 42.82,26.48 | HD2.1 42.79,26.51
  Top 1.778: PWR_OUT.2 1.81,34.22 1.81,24.47 2.1,24.19 12.07,24.19 13.83,22.44 v13.83,22.41
  Bottom 0.2: v59.7,9.56 v59.69,9.55 59.54,9.55 59.1,9.11
  Bottom 0.254: 42.09,4.65 42.11,4.63 42.07,4.63 41.99,4.55
  Bottom 0.61: 88,24.7 88,24.73 MD1.20 | 30.57,5.44 30.5,5.36 30.28,5.14 v30.28,4.75 | 88.18,25.75 C45.1
  Bottom 0.813: 59.11,9.08 v59.7,9.56 59.4,9.41 | v59.1,1.81 59.1,9.11
  Bottom 1.016: MD1.21 88.18,25.75 MD1.20 90.63,24.73 v90.63,24.71 v90.62,24.71
  Bottom 1.27: C23.1 39.14,4.31 38.53,4.92 C24.C | 42.03,4.59 42.09,4.65 42.17,4.73 | 41.99,4.55 41.99,3.99 | v99.26,24.3 99.28,24.3 99.29,24.31 99.29,17.96 100.87,16.38 | 100.87,16.38 100.88,16.37 | v100.79,16.38 100.87,16.38
  Bottom 1.422: REG4.4 REG4.2 | REG4.4 28.69,7.28 28.71,7.31 | REG4.4 28.65,7.24 28.63,7.22 30.5,5.36 30.56,5.3 C77.C 36.67,5.3 37.03,4.94 C24.C | 41.58,3.67 41.56,3.65 | 41.58,3.67 3V3(2).1 | 41.99,3.99 41.9,3.99 41.58,3.67
  Bottom 1.676: 42.17,4.73 42.17,14.65 39.58,17.24 39.58,19.21 42.72,22.35 42.72,26.36 42.83,26.47 42.79,26.51 HD2.1
  Bottom 1.778: 38.53,4.92 38.52,4.92 | 38.53,4.92 | 42.03,4.59 41.71,4.92 38.53,4.92 | v13.83,22.41 15.2,21.04 17.74,21.04 19.34,19.44 19.34,16.9 20.46,15.78 33.87,15.78 37.72,11.93 37.72,8.41 36.76,7.46 36.76,5.21 37.05,4.92 | 37.05,4.92 | 37.05,4.92 C24.C
5V_(1)  (via drill 0.5, 0.6)
  Top 0.254: IC1.19 73.12,50.92 72.77,50.58 69.58,50.58 68.93,51.23 67.81,51.23 | 67.81,51.23 67.8,51.23 | C71.1 67.81,51.23
  Top 0.305: ANALOG_PORT.11 64.77,12.4 62.83,12.4 62.24,12.99 62.24,14.51 60.36,16.39 60.36,18.05 60.56,18.25 60.86,18.25 REF1.1 | REF1.1 60.9,18.29 | REF1.1
  Top 0.5: C71.1 67.85,51.89 67.85,52.81 66.21,54.45 v64.56,54.45 v64.55,54.44
  Top 0.61: C72.C 65.27,52.68 65.24,52.68 65.24,53.75 v64.55,54.44 | v47.73,5.44 45.63,5.44 45.02,4.83 43.57,4.83 42.95,5.45 40.1,5.45 38.2,3.55 28.95,3.55 28.22,4.28 28.22,4.53 28.25,4.53
  Top 0.813: C72.C 65.27,52.58 | 34.06,17.55 34.06,17.53 R1.2 | v104.37,46.29 89.45,46.29 88.82,46.76 88.82,48.32 88.43,48.71 86.11,48.71 85.85,48.97 84.75,48.97 v84.75,48.96 v84.74,48.95 | 83.2,63.84 83.2,63.85 v83.21,63.84 v83.22,63.84 | 61.3,50.53 v61.3,50.5 v61.31,50.49 61.31,50.51 60.9,50.92 57.33,50.92 56.94,50.53 v56.83,50.64
  Top 0.9: REG1.6 26.08,27.77 26.53,27.32 26.53,23.72 27.43,22.82 29.85,22.82 30.86,21.81 30.86,16.86 30.84,16.84 | 30.84,16.84 30.79,16.79 | L1.2 30.84,16.84 | C11.+ 35.98,17.47 35.96,17.45 35.96,16.35 | C13.C 36.02,14.09 36.35,13.76 C12.1
  Top 1.016: C67.C 25.83,3.6 27.4,3.6 28.25,4.45 28.25,4.53 28.25,8.29 30.35,10.39 30.35,16.49 30.74,16.88 30.88,16.88 30.88,16.87 L1.2
  Top 1.27: 36.74,61.46 36.65,61.37 35.44,60.16 35.44,54.54 36.29,53.69 36.29,53.15 36.39,53.05 | C17.C 58.49,63.31 55.74,63.31 55.74,63.28 55.7,63.28 v55.68,63.26
  Top 1.422: L1.2 31.05,16.84 31.74,17.53 34.06,17.53 34.08,17.53 34.16,17.45 35.96,17.45 | 35.96,16.35 35.96,16.15 36.06,16.05 36.02,16.01 C13.C 35.96,14.13 35.96,13.09 | v66.66,65.81 75.2,65.81 77.17,63.84 83.2,63.84 v83.22,63.84 | 33.98,11.27 33.96,11.25 | 33.98,11.27 5V(1).1 | C12.1 34.9,12.19 33.98,11.27
  Top 1.676: C11.+ 35.98,18.62 33.39,21.21 v33.39,22.3 | v39.4,37.41 36.39,40.43 36.39,53.05 | C17.C 55.73,63.15 55.67,63.21
  Top 1.93: 55.74,63.31 v55.68,63.25 54.36,63.25 52.96,61.85 37.16,61.85 36.76,61.45 36.56,61.45 36.65,61.37
  Bottom 0.254: IC2.19 51.3,51.22 51.42,51.09 53.2,51.09 53.26,51.03 53.27,51.04 C65.1
  Bottom 0.305: 72.39,14.52 72.39,6.03 70.86,4.49 67.96,4.49 65.12,7.33 C50.C
  Bottom 0.406: HOST.1 78.48,13.58 76.91,15.15 73.03,15.15 72.39,14.52
  Bottom 0.61: v64.55,54.44 63.28,53.17 62.29,53.17 62.51,52.95 62.51,52.32 | 62.51,52.32 62.51,52.31 | 62.51,52.32 REG3.3 62.5,52.33 62.52,52.33 | v56.83,50.64 C66.C
  Bottom 0.813: 84.45,39.06 84.46,39.05 | 84.45,39.06 HD1.4 | 84.45,39.06 81.38,42.13 C27.C 81.03,45.16 84.1,48.23 84.1,48.96 v84.75,48.96 | v104.37,46.29 109.07,46.29 110.87,48.09 110.87,54.07 106.64,58.3 | v83.22,63.84 v83.23,63.83 83.23,59.25 84.17,58.31 94.55,58.31 94.54,58.32 C64.C | C64.C 94.54,60.29 | C64.C 94.55,60.13 94.86,59.82 105.12,59.82 106.64,58.3 | 106.64,58.3 106.63,58.31 | ANALOG_PORT.11 66.04,7.7 65.92,7.58 64.64,7.58 64.38,7.32 64.38,1.43 63.68,0.73 49.72,0.73 48.22,2.23 48.22,4.95 v47.73,5.44 | v61.31,50.49 v61.31,50.48 61.32,50.47 62.52,51.67 62.52,52.33 | v84.75,48.96 84.81,48.96 | v84.74,48.95 v84.75,48.96
  Bottom 1.016: C66.C 55.34,51.74 55.31,51.77 54.63,51.09 C65.1 | 66.02,11.15 66.02,11.16 | ANALOG_PORT.11 66.02,11.15 | C50.C 66.02,8.23 66.02,11.15 | 80.16,39.6 80.16,39.65 | 80.16,39.6 C25.C | HD1.4 80.16,39.06 80.16,39.6 | C26.1 82.16,38.61 82.16,39.06 HD1.4 | 84.34,39.05 84.36,39.05 | HD1.4 84.34,39.05 | 84.34,39.05 83.7,39.05 | 62.29,53.17 62.31,53.15 62.31,53.12 62.74,53.55 62.81,53.55 62.81,53.69 62.82,53.7
  Bottom 1.422: REG4.3 22.45,13.39 22.49,13.44 C21.C 32.02,13.48 34.16,11.34 34.16,11.25 5V(1).1 | 55.68,63.23 60.48,63.23 60.51,63.23 64.07,63.23 66.25,65.41 66.26,65.41 v66.66,65.81
  Bottom 1.676: v33.39,22.3 33.81,22.73 38.15,22.73 39.4,23.99 v39.4,37.41 | 62.82,53.7 62.82,60.89 60.48,63.23 60.49,63.23 60.51,63.21 60.51,63.23 | v55.68,63.26 55.68,63.23
5V_(2)  (via drill 0.5)
  Top 0.813: C39.C 91.14,60.44 C38.1 | HD_CAM2.4 24.15,56.39 24.15,60.98 23.59,61.54 | 23.59,61.54 23.51,61.62 | 23.59,61.54 C40.+ | 21.98,52.48 21.98,52.58
  Top 0.9: REG2.6 15.51,53.03 16.06,52.48 20.16,52.48 | L2.2 32.08,51.28 32.05,51.25 30.82,52.48 21.98,52.48 20.16,52.48 | 20.16,52.48 20.16,52.49 20.17,52.5 v20.17,52.71 20.17,52.73 20.21,52.77 20.18,52.8 C16.C 21.33,55.03 22.01,55.71 21.98,55.74 C15.1 | 20.2,52.74 20.26,52.8 20.26,53.1 22.13,53.1 | R2.2 20.81,61.34 23.04,61.34 23.09,61.39 23.57,61.39 23.57,61.47 C40.+ | 91.15,57.92 91.15,59.45 91.2,59.5
  Top 1.016: 87.78,56.35 87.71,56.28 | 87.78,56.35 HD_CAM1.4 87.8,56.38 87.86,56.44 89.67,56.44 91.15,57.92 C39.C | 87.78,56.35 87.91,56.48 | C37.+ 86.48,61.27 87.85,62.64 90.19,62.64 90.56,62.27 90.56,61 | 90.56,61 90.54,61.02 C38.1 | 90.56,61 90.6,60.96 | 51.46,64.17 51.46,64.08 51.38,64 | C15.1 22.13,55.65 23.41,55.65 24.15,56.39
  Top 1.27: 23.63,61.44 23.64,61.45 C40.+ | v20.17,52.71 20.2,52.74 32.79,52.74 32.79,54.17 33.76,55.24 33.76,62.75 34.95,63.84 35.11,64 51.38,64 | 51.46,64.17 51.5,64.12 | 101.07,59.49 101.07,59.52 C31.+
  Top 1.422: C40.+ 23.62,61.52 23.59,61.52 23.59,68.22 5V(2).1 | 51.5,64.12 53.06,65.68 | v34.97,63.77 34.97,63.81 34.95,63.84
  Top 1.676: 53.06,65.68 62.7,65.68 | 62.7,65.68 v63.11,66.09 | 62.7,65.68 62.7,65.78 65.14,68.22 77.94,68.22 | 77.94,68.22 85.89,68.22 | 85.89,68.22 96.88,68.22 97.51,67.59 97.42,67.5 97.42,61.09 99.02,59.49 101.07,59.49 | C37.+ 84.92,61.78 85.91,62.77 85.91,68.18 85.89,68.2 85.89,68.22 | 77.94,68.22 77.94,68.2 78,68.14 v78,66.08 | v34.97,63.77 34.98,63.77 35,63.75 32.74,61.49 C60.+ | C31.+ 101.38,59.62 103.98,62.22 103.98,63.64 104.27,63.93 107.29,63.93 107.29,63.9 ULTRA_ON.2
  Top 1.93: SERVOS.2 67.73,58.92 67.76,58.95 75.36,58.95
  Bottom 0.813: HD_CAM2.4 24.13,57.25 25.55,58.66 25.59,58.62 C41.1 25.7,59.95 C42.C
  Bottom 0.9: C14.+ v20.16,52.72 v20.17,52.71 | C42.C 25.44,60.22
  Bottom 1.422: C59.+ 33.36,60.31 35,61.95 35,63.74 v34.97,63.77
  Bottom 1.676: 20.22,52.76 20.28,52.76 | 20.22,52.76 v20.17,52.71 | PWR_OUT.1 8.05,42.71 14.27,48.93 14.27,50.77 16.28,52.78 17.4,52.78 17.42,52.76 20.22,52.76 | 63.07,66.08 63.08,66.08 63.09,66.09 v63.11,66.09 | C56.+ 80.59,60.77 78.01,63.35 v78.01,66.07 v78,66.08
  Bottom 1.778: SERVOS.14 75.41,58.95 79.6,58.95 C56.+ | SERVOS.2 65.19,58.97 | 63.07,66.08 C57.+
  Bottom 1.93: SERVOS.2 67.73,58.92 67.76,58.95 SERVOS.5 70.23,58.92 70.26,58.95 70.29,58.92 SERVOS.8 72.83,58.92 72.86,58.95 SERVOS.11 75.33,58.92 75.36,58.95 SERVOS.14
  pour Top (isolate 0.813): 76.22,67.35 76.22,67.17 77.74,65.65 84.02,65.65 84.59,65.08 84.59,62.15 85.51,61.23 90.14,61.23 90.35,61.02 90.35,58.07 89.65,57.37 87.84,57.37 87.46,56.99 87.46,55.12 87.42,55.08 92.23,55.08 93.68,53.63 103.47,53.63 104.03,54.19 104.03,61.27 104.24,61.48 97.86,60.75 95.44,68.33 76.66,68.44 76.43,68.21
12V_SAFE  (via drill 0.5)
  Top 0.9: 10.84,52.39 10.83,52.38 10.43,52.78 REG2.2 | 10.84,52.39 C8.1 | 10.84,52.39 10.84,51.06 10.87,51.03 10.84,51 C7.1 10.9,50.9 | v12.11,37.2 12.17,37.2 12.19,37.18 12.73,37.18 v13.37,37.18 12.72,37.18 12.7,37.16 | REG1.2 24.03,32.85 | 17.81,31.44 18.73,32.36 19.01,32.36 | 19.01,32.36 19.57,32.36 19.63,32.42 19.68,32.37 C4.1 21.17,32.37 21.18,32.36 C3.1 21.66,32.85 REG1.2 | REG1.2 24.05,32.85 | 17.81,33.73 C1.+ 17.81,29.5 17.82,29.49 17.8,29.47 17.8,28.95 19.95,26.8 v19.95,26.35 | 17.81,33.73 v18.36,34.28 | 19.01,32.36 19.01,32.44 17.81,33.64 17.81,33.73
  Top 1.016: 10.59,48.97 10.59,49.14 10.84,49.39 C7.1
  Top 1.676: C5.+ 3.69,48.6 4.06,48.97 10.59,48.97 C6.+
  Top 1.778: C5.+ 3.68,48.68 4.52,48.68 8.25,44.95 8.25,41.58 10.61,39.22 D1.A 13.22,39.05 12.73,38.56 12.73,37.18
  Bottom 0.813: C2.+ 22.34,23.6 20.62,23.6 19.94,24.28
  Bottom 0.9: v19.95,26.35 19.95,26.33 19.94,26.32 19.94,24.28
  Bottom 1.422: v18.36,34.28 18.36,34.69 15.86,37.19 12.49,37.19 12.47,37.17 12.44,37.2 v12.11,37.2
!CS
  Top 0.406: 86.89,46.64 SPI.1 86.91,46.64 | 86.91,46.64 86.93,46.64 | T2.3 85.92,46.64 86.91,46.64
  Bottom 0.813: R19.2 89.34,45.01 87.65,46.7 86.8,46.7 86.77,46.67 | 86.77,46.67 86.72,46.62 | SPI.1 86.77,46.67
!MCLR  (via drill 0.5)
  Top 0.2: 55.16,32.25 55.18,32.27 v55.25,32.27 | 55.01,32.5 v55.24,32.27 v55.25,32.27 | MCU.13 55.44,33.72 55.02,33.3 55.02,32.46 55.25,32.23 v55.25,32.27
  Top 0.61: U$46.1 46.21,24.52 | U$46.1 | U$46.1 45.41,23.72 R13.1 42.18,23.72 | 42.18,23.72 42.19,23.73 | 42.18,23.72 42.14,23.68 41.43,23.68 41.04,23.29 41.04,20.17 40.41,19.54 40.41,17.15 40.42,17.14 40.44,17.14 41.01,16.57 41.01,14.26 41.02,14.25 41.02,8.69 42.22,7.49 SWT3.4
  Top 1.27: 55.52,7.49 SWT3.3 | SWT3.4 55.52,7.49 | 55.52,7.49 55.56,7.45
  Bottom 0.2: U$46.1 46.16,24.51 47.89,24.51 48.52,25.14 48.52,29.45 49.18,30.11 53.02,30.11 55.18,32.27 v55.25,32.27
!SS1  (via drill 0.5)
  Top 0.2: MCU.69 82.26,36.12 83.06,36.92 83.06,40.32 83.71,40.97 v84.27,40.97 v84.28,40.98
  Top 0.305: T2.1 81.84,47.67 81.84,46.23 83.32,44.75 v83.32,44.47 v83.33,44.46 83.31,44.46 83.29,44.44 83.95,43.78 R18.1 84.63,43.78 86.25,45.4 103.77,45.4 108.48,40.69 U1.2
  Bottom 0.2: v84.28,40.98 84.28,41.12 84.25,41.15
  Bottom 0.305: v83.32,44.47 83.32,44.49 | v83.32,44.47 v83.33,44.46 | 84.25,41.15 83.32,42.08 v83.32,44.47
AERXD1/INT2/RE9
  Top 0.2: MCU.19 58.07,31.32 54.89,28.14 54.89,22.22 54.52,22.22 R14.2
AERXERR/RG1_5V
  Bottom 0.2: IC2.14 48.05,53.28 47.1,54.23 37.61,54.23 36.52,55.32 36.52,64.98 37.85,66.31 IO_5V_INTERFACE.6
AERXERR/RG15  (via drill 0.5)
  Top 0.2: MCU.1 59.4,38.52 59.22,38.7 v59.22,39.33 v59.23,39.34 v59.22,39.34
  Bottom 0.2: IC2.7 48.05,46.36 48.06,46.35 48.04,46.33 48.04,45.1 49.65,43.49 51.71,43.49 55.55,39.65 58.96,39.65 59.22,39.39 v59.22,39.34
AN0  (via drill 0.5)
  Top 0.2: 60.79,28.91 60.78,28.92 MCU.25 59.43,28.92 58.56,28.05 58.56,27.25 58.52,27.21 v58.46,27.21
  Bottom 0.406: 54.64,23.35 54.64,24.14 55.57,25.07 56.31,25.07 56.35,25.11 56.34,25.12 R17.1 56.3,26.63 56.82,27.15 58.41,27.15 58.46,27.1 58.47,27.11 v58.46,27.21 | D6.1 59.51,29.58 59.51,28.65
  Bottom 0.61: 58.47,27.19 v58.46,27.21 58.46,27.16 58.45,27.16 | R16.1 54.64,23.35
  Bottom 0.813: v58.46,27.21 58.49,27.17 | 58.47,27.19 58.47,28.16 58.96,28.65 59.51,28.65 60.16,28.65 D5.2
AN1
  Top 0.2: ANALOG_PORT.8 60.96,14.85 | 60.96,14.85 60.96,14.91 | MCU.24 59.3,29.32 57.56,27.58 57.56,18.25 60.96,14.85
AN2
  Top 0.2: MCU.23 60.73,29.72 60.72,29.71 60.71,29.72 59.04,29.72 57.16,27.84 57.16,15.45 58.56,14.05 58.56,13.65 58.44,13.65 ANALOG_PORT.6
AN3
  Top 0.2: MCU.22 60.74,30.12 60.73,30.11 60.72,30.12 58.79,30.12 56.76,28.09 56.76,15.45 55.76,14.45 55.76,13.65 55.86,13.65 ANALOG_PORT.4
AN4
  Top 0.2: MCU.21 58.55,30.52 56.36,28.33 56.36,15.85 55.56,15.05 53.76,15.05 53.36,14.65 53.36,13.69 ANALOG_PORT.2
AN5
  Top 0.2: ANALOG_PORT.1 52.32,11.13 52.07,11.37 52.07,14.74 52.07,14.96 52.56,15.45 55.36,15.45 55.96,16.05 55.96,28.58 58.3,30.92 MCU.20
AN8
  Top 0.2: 65.06,27.07 MCU.32 65.06,21.34 65.27,21.13 65.27,15.89 63.93,14.55 63.93,14.07 63.53,13.67 ANALOG_PORT.10
AN9
  Top 0.2: MCU.33 65.46,21.59 65.85,21.2 65.85,14.05 66.1,13.8 66.04,13.74 ANALOG_PORT.12
AN10
  Top 0.2: MCU.34 65.86,21.78 66.39,21.25 66.39,15.63 67.01,15.01 68.1,15.01 68.53,14.58 68.53,13.92 68.61,13.84 68.58,13.81 ANALOG_PORT.14
AN11
  Top 0.2: MCU.35 66.26,21.95 66.86,21.35 66.86,15.87 67.31,15.42 70.19,15.42 71.11,14.5 71.11,13.73 71.14,13.7 ANALOG_PORT.16
AN12
  Top 0.2: ANALOG_PORT.18 73.7,13.72 73.69,13.73 73.69,14.72 73.44,14.97 71.29,14.97 69.16,17.1 69.16,23.45 68.66,23.95 MCU.41
AN13
  Top 0.2: MCU.42 69.06,24.09 69.57,23.58 69.57,17.29 71.44,15.42 75.76,15.42 76.13,15.05 76.13,13.77 76.21,13.69 ANALOG_PORT.20
AN14
  Top 0.2: MCU.43 69.46,24.32 69.96,23.82 69.96,17.57 71.63,15.9 76.43,15.9 77.81,14.52 77.81,12.25 76.56,11 76.43,11.13 ANALOG_PORT.19
AN15
  Top 0.2: MCU.44 69.86,24.54 70.42,23.98 70.42,17.79 71.06,17.15 71.07,17.15 71.84,16.38 76.65,16.38 78.42,14.61 78.42,11.14 77.12,9.84 74.05,9.84 73.65,10.24 73.65,10.99 73.67,11.01 73.66,11.02 ANALOG_PORT.17
AN_OUT5V  (1 unrouted)
  Top 0.406: HD3.3 94.79,52.38 94.76,52.35 94.86,52.25 94.86,50.65 92.69,48.48 91.54,48.48 91.54,48.5
C1RX/ETXD1/PMD11/RF0
  Top 0.2: MCU.87 67.86,43.85 65.26,46.45 59.96,46.45 59.56,46.85 55.16,46.85 54.36,47.65 54.36,52.65 51.79,55.22 51.79,55.76 | PARALLEL_PORT.12 50.5,58.6 51.79,57.31 51.79,55.76 | 51.79,55.76 51.79,55.73
C1TX/ETXD0/PMD10/RF1
  Top 0.2: MCU.88 67.46,43.66 65.07,46.05 59.76,46.05 59.36,46.45 54.96,46.45 53.96,47.45 53.96,52.45 50.56,55.85 50.56,56.36 PARALLEL_PORT.11 | PARALLEL_PORT.11 50.5,56.44 | PARALLEL_PORT.11 50.5,56.24
C2RX/PMD8/RG0
  Top 0.2: MCU.90 66.66,43.38 64.81,45.23 59.43,45.23 58.99,45.67 54.58,45.67 53.18,47.07 53.18,47.17 | 53.18,47.17 53.18,50.81 | 53.18,50.81 53.18,50.86 | PARALLEL_PORT.9 47.96,56.38 48.01,56.33 47.97,56.29 47.97,55.91 49.43,54.45 50.73,54.45 53.18,52 53.18,50.81 | 53.18,47.17 53.18,47.15
C2TX/ETXERR/PMD9/RG1
  Top 0.2: PARALLEL_PORT.10 49.23,57.69 49.23,55.58 49.96,54.85 50.96,54.85 53.56,52.25 53.56,47.25 54.76,46.05 59.16,46.05 59.56,45.65 64.92,45.65 67.06,43.51 MCU.89
CAM1_RX_IN
  Top 0.2: HD_CAM1.1 80.16,56.35 80.06,56.45
  Top 0.254: IC1.14 76.37,55.06 77.36,56.05 79.76,56.05 80.16,56.45 HD_CAM1.1
CAM1_TX_OUT
  Top 0.2: 82.76,56.25 82.7,56.31 HD_CAM1.2
  Top 0.254: IC1.13 77.02,54.7 77.36,55.05 82.36,55.05 82.76,55.45 82.76,56.45 HD_CAM1.2
CAM2_RX_IN
  Bottom 0.2: IC2.13 47.4,53.25 46.94,53.7 46.93,53.7 46.85,53.78 33.84,53.78 31.76,55.86 HD_CAM2.1 | HD_CAM2.1 31.76,56.45 | HD_CAM2.1
CAM2_TX_OUT
  Bottom 0.2: IC2.12 46.75,53.23 46.66,53.31 32.28,53.31 29.27,56.32 29.27,56.4 29.22,56.4 HD_CAM2.2
CX9
  Top 0.9: C9.2 24,36.77 REG1.1 23.94,34.12 23.9,34.16 23.87,34.13 22.19,34.13 22.19,34.84 | L1.1 20.01,18.98 18.36,20.63 16.8,20.63 16.07,21.36 16.07,35.04 17.63,36.6 18.72,36.6 20.42,34.9 22.11,34.9 22.17,34.84 22.19,34.84 | D2.A 22.19,36.23 22.19,34.84
CX10  (via drill 0.5)
  Top 0.2: 8.86,51.14 8.99,51.27 v8.99,51.32 v8.98,51.32 8.98,51.43 | 8.98,51.43 8.96,51.45 | 9.13,51.41 9,51.41 8.98,51.43
  Top 0.9: 9.16,53.96 REG2.1 | 9.16,53.96 9.16,53.57 8.53,52.94 7.48,52.94 6.72,53.5 C10.2 | D3.A 3.8,58.39 5.2,56.99 5.2,52.9 6.96,51.14 8.86,51.14 | 9.16,53.96 9.14,53.96 9.13,53.95 9.13,51.41 | L2.1 32.05,40.38 32.02,40.35 31.99,40.38
  Top 1.016: 31.99,40.38 25.34,47.03 9.19,47.03 v8.86,47.36 | 9.04,51.41 8.96,51.33 v8.97,51.32 v8.98,51.32
  Bottom 1.016: v8.86,47.36 8.86,51.2 v8.98,51.32
D+  (via drill 0.5)
  Top 0.2: v79.31,30.82 79.31,31.07 79.33,31.09 79.1,31.32 MCU.57
  Top 0.5: U$47.D+ 86.94,19.4 v85.87,20.47
  Bottom 0.305: v85.87,20.47 85.74,20.47 84.35,21.86 82.36,21.86 81.81,22.41 81.81,28.79 79.79,30.81 v79.32,30.81 v79.31,30.82 79.76,30.82
D-  (via drill 0.5)
  Top 0.2: MCU.56 78.24,30.92 78.51,30.65 78.51,29.58 78.67,29.42 79.3,29.42 79.32,29.44 v79.32,29.55
  Top 0.5: U$47.D- 86.14,18.16 84.47,19.83 84.47,20.43 84.46,20.43 v84.44,20.41
  Bottom 0.305: v79.32,29.55 79.33,29.46 79.36,29.43 80.1,29.43 81.14,28.39 81.14,21.81 81.79,21.16 83.69,21.16 v84.44,20.41
DBG_TO_PC
  Top 0.2: MCU.50 72.26,26.48 72.73,26.48 74.36,24.85 74.36,22.45 74.76,22.05 75.36,22.05 75.44,22.13
  Top 1.27: 75.76,22.05 TX_DBG.1 75.68,22.13 75.44,22.13
EMDC/AEMDC/IC4/PMCS1/PMA14/RD
  Top 0.2: ANALOG_PORT.13 68.58,10.9 70.48,9 77.65,9 77.66,9 79.41,10.75 79.41,10.74 79.49,10.82 79.49,15.28 77.43,17.34 77.43,20.62 78.26,21.45 86.53,21.45 89.63,24.55 89.63,25.41 | MCU.71 81.69,36.92 82.09,37.32 82.09,41.08 83.33,42.32 85.02,42.32 85.59,41.75 85.59,40.93 85.61,40.91 85.62,40.92 86.22,40.32 87.69,40.32 88.29,39.72 88.29,35.36 88.65,35 88.65,34.73 | 89.63,25.41 89.63,28.85 88.65,29.83 88.65,34.73 | 88.65,34.73 88.65,34.8 | 89.63,25.41 89.63,25.4
EN1/RA4
  Top 0.2: MCU.60 69.71,32.52 69.71,32.53 69.31,32.93 69.31,34.83 73.59,39.11 73.59,39.51 77.56,43.48 77.56,44.45 78.31,45.2 IC1.10
EN2/RA5  (via drill 0.5)
  Top 0.2: MCU.61 74.28,32.92 74.27,32.91 74.26,32.92 71.09,32.92 v70.4,33.61 70.36,33.65
  Bottom 0.2: IC2.10 46.09,44.53 48.67,41.95 50.89,41.95 54.74,38.1 57.71,38.1 63.14,32.67 69.38,32.67 70.36,33.65 v70.4,33.61
EOC/INT1
  Top 0.2: MCU.18 57.83,31.72 56.23,30.12 56.23,30.13 53.06,30.13 52.07,29.14 52.07,21.76 51.16,20.85 50.16,20.85 50.17,20.86 HD4.3
ETXCLK/PMD15/CN16/RD7
  Top 0.2: MCU.84 69.07,43.93 69.76,44.62 69.76,45.45 68.96,46.25 66.16,46.25 65.56,46.85 63.56,46.85 62.16,48.25 62.16,59.58 61.29,60.45 56.36,60.45 55.56,59.65 55.56,59.05 55.58,59.03 PARALLEL_PORT.16
ETXD2/IC5/PMD12/RD12
  Top 0.2: PARALLEL_PORT.13 53.04,56.94 51.76,58.22 51.76,60.05 52.16,60.45 53.76,60.45 54.96,61.65 61.96,61.65 63.36,60.25 63.36,48.85 64.16,48.05 66.16,48.05 66.76,47.45 69.56,47.45 70.96,46.05 70.96,45.25 71.16,45.05 72.56,45.05 73.36,44.25 73.36,43.05 72.68,42.37 72.68,42.36 71.97,42.36 71.06,41.45 MCU.79
ETXD3/PMD13/CN19/RD13
  Top 0.2: MCU.80 70.66,41.68 71.78,42.8 72.43,42.8 72.98,43.35 72.98,44.06 72.51,44.53 71.08,44.53 70.56,45.05 70.56,45.85 69.36,47.05 66.56,47.05 65.96,47.65 63.96,47.65 62.96,48.65 62.96,60.05 61.76,61.25 55.16,61.25 53.36,59.45 53.36,59.25 53.07,58.96 PARALLEL_PORT.14
ETXEN/PMD14/CN15/RD6
  Top 0.2: PARALLEL_PORT.15 55.58,56.56 54.29,57.85 54.29,59.78 55.36,60.85 61.56,60.85 62.56,59.85 62.56,48.45 63.76,47.25 65.76,47.25 66.36,46.65 69.16,46.65 70.16,45.65 70.16,44.45 69.45,43.74 MCU.83
GND  (via drill 0.3, 0.5, 0.6 pad 0.25)
  Top 0.2: C54.2 62.28,21.24 62.28,17.43 62.87,16.84 63.49,16.84 C55.A | 59.76,21.66 59.76,21.69 | REF1.3 58.55,19.29 58.58,19.29 | MCU.31 64.66,21.12 64.85,20.93 64.85,17.52 64.83,17.52 64.16,16.85 63.36,16.85 63.38,16.87 C55.A | C55.A 63.55,16.84 | MCU.36 66.66,23.23 67.23,22.66 67.28,22.71 C79.2 67.52,21.7 v67.67,21.54 | MCU.45 70.26,24.77 70.9,24.13 70.9,22.64 71.15,22.39 C81.2 71.93,22.39 71.93,21.74 71.29,21.1 v71.29,21.08 | C51.2 60.9,21.71 59.57,21.71 59.78,21.5 | MCU.75 74.74,38.95 v74.74,39.34 74.74,39.41 74.74,39.43 74.76,39.45 | 79.49,34.52 MCU.65 | 79.49,34.52 79.5,34.53 | 82.1,33.06 v82.07,33.03 82.07,32.97 80.52,34.52 79.49,34.52 | v79.68,32.72 v79.68,32.73 79.59,32.82 C87.2 | C76.2 52.34,33.21 | C76.2 52.63,32.92 | C78.A 50.48,34.33 | C78.A 50.24,34.35 50.27,34.32 | MCU.15 57.1,32.92 56.07,31.89 | C76.2 52.36,33.14 | C78.A 50.17,34.37 50.17,35.47 49.9,35.74 v49.9,36.14 | C74.2 54.85,39.63 v51.56,39.63 | C69.A 80.03,52.72 79.96,52.65 79.16,52.65 79.16,52.85 78.76,53.25 78.76,53.45 78.56,53.65 | C76.2 52.36,33.25 52.96,33.25 53.36,32.85 53.36,31.85 53.76,31.45 55.63,31.45 56.07,31.89 | v56.16,33.02 56.16,31.98 56.07,31.89
  Top 0.254: 78.32,51.87 78.32,51.04 77.93,50.65 73.81,50.65 73.25,50.09 73.25,50.1 69.43,50.1 69.02,49.69 67.35,49.69 C71.2 | 74.74,39.41 74.76,39.43 | 76.56,3.5 76.61,3.55 77.69,3.55 77.6,3.46 v74.57,3.46 v74.56,3.45 | v78.55,53.61 78.55,53.64 78.56,53.65 78.31,53.41 IC1.11
  Top 0.305: U1.6 107.08,36.3 104.2,39.18 97.14,39.18 96.79,39.53 C53.2 | 96.98,50.15 T1.2 | 96.98,50.15 96.94,50.15 | v104.07,47.55 104.07,47.54 103.75,47.22 | v66.66,52.59 66.69,52.56 66.69,50.84 65.4,49.55 | 103.75,47.22 103.75,47.23 v104.08,47.56 | 103.75,47.22 96.26,47.22 95.69,47.79 95.69,49.76 96.08,50.15 96.98,50.15 | v49.79,12.44 50.36,12.44 51.56,13.64 51.56,17.59 50.85,18.3 50.24,18.3 HD4.2 50.24,18.33 | 82.91,46.77 82.96,46.77 83.89,47.7 83.89,49.29 83.26,49.92 83.26,51.08 82.27,52.07 C68.2 82.18,52.07 | 74.76,39.43 74.76,39.45 74.76,39.85 78.56,43.65 | 80.56,40.74 C96.2 | 78.56,43.65 78.56,44.05 | 78.56,43.65 78.56,43.05
  Top 0.406: 59.26,21.66 R15.2 | C51.2 59.76,21.66 | 59.76,21.66 59.26,21.66 | R18.2 84.2,45.58 84.15,45.53 82.91,46.77 T2.2 | C46.A 92.51,21.83 92.59,21.75 92.61,21.77 93.6,21.77 | C44.A 96.24,21.66 96.59,21.66 | 59.26,21.66 59.07,21.66 58.27,22.46 58.27,24.5 58.31,24.54 v58.29,24.56 v58.28,24.56 | 58.58,19.29 58.6,19.27 61.76,19.27 61.88,19.15 61.88,17.43 61.4,16.95 v61.4,16.83 | 80.76,40.65 80.76,40.54 C96.2 | 80.76,38.18 C97.2 | 58.55,19.29 59.76,20.5 59.76,21.66
  Top 0.5: U$47.GND 88.54,14.89 89.21,15.56 91,15.56 91.02,15.56 | 92.34,11.64 92.35,11.63 | 92.34,11.64 U$47.GND@2 | 92.33,14.01 92.33,11.65 92.34,11.64 | 92.38,4.25 92.37,4.27 92.33,4.3
  Top 0.61: U1.6 114.06,36.3 | LD2.C 15.74,66.2 15.68,66.2 15.5,66.2 15.45,66.15 13.09,63.79 13.09,63.61 | 13.09,63.61 13.09,63.57 | REG2.8 13.09,63.61 | 46.17,19.35 46.29,19.23 | 46.17,19.35 U$46.3 | 46.17,19.35 45.27,20.25 C58.2 44.56,19.26 44.56,9.83 v45.54,8.85 | 79.16,22.99 79.11,22.99 | 79.16,22.99 v79.21,22.94 79.31,22.94 79.31,26.2 C48.2 | 79.16,22.99 80.26,22.99 80.27,23 83.3,23 v83.51,22.79 | 58.47,19.27 REF1.3 | LD1.C 37.98,10.07 37.99,10.05 LD4.C | GPS.3 47.95,39.39 45.45,36.89 42.84,36.89 | LD3.C 41.45,41.02 40.85,40.42 40.85,38.36 42.55,36.66 42.57,36.67 HD2.5 | 110.45,30.54 110.41,30.58 110.26,30.73 R12.1 | v51.37,3.4 52.82,3.4 v52.82,3.42
  Top 0.813: C38.2 88.15,60.35 C39.A | C72.A 65.4,49.55 C71.2 | C95.1 87.85,26.05 86.35,26.05 86.35,25.99 X3.2 86.4,25.96 86.55,25.81 | 85.24,24.23 C94.2 | 86.27,26 85.24,24.97 85.24,24.23 | C49.A 79.19,24.62 79.23,24.66 79.18,24.71 C48.2 | C46.A 91.74,22.67 v90.58,22.67 | LD6.C | LD5.C LD6.C | LD6.C LD7.C | C12.2 38.06,10.72 LD1.C | 26.68,56.4 26.68,56.26 | HD_CAM2.3 26.68,56.4 | 28.01,59.91 26.68,58.58 26.68,56.4 | 62.48,3.48 62.48,3.45 v62.51,3.45 | 57.8,3.45 57.8,3.48 57.81,3.49 | 108.61,28.14 108.59,28.16 108.59,28.78 109.89,30.08 109.89,30.07 | U1.GND3 113.1,33.28 110.41,30.58 109.89,30.07 | 109.89,30.07 109.65,29.83 | 92.37,4.27 92.35,4.25 92.33,4.27 92.33,14.01 91,15.34 91,15.56 91,17.65 91.65,18.3 | 94.33,21.79 94.33,21.77 v94.33,21.07 | 77.21,61.54 77.21,61.5 77.21,57.07 v77.19,57.05 | C32.2 105.88,55.32 | C32.2 105.94,55.32 105.95,55.33 107.43,53.85 R26.2 | C32.2 105.86,55.3 105.86,53.37 HD3.7 | 105.84,55.22 105.8,55.18 | 105.84,55.22 C32.2 | 107.23,57.73 107.23,56.61 105.84,55.22 | C33.A 108.28,57.81 v109.89,59.42 | C55.A 63.48,16.83 v61.4,16.83 | 91.65,18.3 91.66,18.31 | 93.27,18.33 v93.25,18.31 v93.24,18.3 91.65,18.3 | 85.24,24.23 85.24,23.43 84.65,22.84 83.47,22.84 v83.51,22.8 v83.51,22.79 | 60.73,48.31 v60.75,47.99 | C69.A 79.43,52.73 v78.55,53.61 | C96.2 80.77,40.46 80.76,40.45 80.76,38.18 | 80.56,40.74 80.56,41.25 79.96,41.85 79.16,41.85 78.56,42.45 78.56,44.05 78.54,44.03 v78.54,43.95 | C76.2 52.22,33.19 51.16,34.25 50.16,34.25 50.15,34.26 C78.A | C22.2 57.75,3.64 57.56,3.45
  Top 0.9: C6.- 24.23,48.89 24.3,48.96 24.22,49.04 24.22,50.3 23.55,50.97 C7.2 C8.2 12.97,52.86 REG2.4 12.97,62.82 12.97,63 13.05,63.08 13.05,63.61 12.94,63.72 12.95,63.73 REG2.8 13.15,63.58 14.44,62.56 | 14.44,62.56 C16.A | C15.2 15.76,61.86 15.04,62.45 14.62,62.79 14.44,62.56 | C4.2 21.11,30.67 21.12,30.66 21.14,30.68 C3.2 21.56,30.31 REG1.4 32.09,30.31 32.46,30.31 32.5,30.27 32.54,30.31 REG1.8 29.89,30.47 30.02,30.47 | 35.98,23.47 35.96,23.45 | 35.98,23.47 C11.- | 36.06,23.55 35.98,23.47 | C12.2 38.05,12.64 | C13.A 39.06,14.15 38.96,14.05 38.96,13.55 | C1.- 17.81,23.2 20.16,20.85 v27.16,20.85
  Top 1.016: 60.92,11.21 60.92,11.17 ANALOG_PORT.7 | 80.11,52.69 80.03,52.69 | 80.11,52.69 C69.A | C68.2 81.58,52.69 80.11,52.69 | 84.91,56.75 85.27,56.39 85.26,56.38 HD_CAM1.3 85.24,56.41 85.19,56.46 85.23,56.5 85.23,57.42 | C39.A 86.86,59.05 85.23,57.42 | C37.- 78.92,60.23 80.17,58.98 83.6,58.98 85.17,57.41 85.18,57.42 85.23,57.42 | X3.2 86.27,26 X3.4 | 50.52,34.32 50.47,34.27 50.39,34.35 C78.A 50.15,35.81 49.87,36.09 v49.87,36.11 | C28.A 46.73,33.89 43.87,36.75 42.98,36.75 42.84,36.89 42.72,36.77 HD2.5 | C6.- 24.12,49.08 24.12,48.83 | 1.98,54.43 1.97,54.44 | v1.98,54.4 1.98,54.43 | C5.- 2.01,54.4 1.98,54.43 | v3.19,14.53 3.31,14.56 3.91,15.16 4.02,15.16 | 4.02,15.16 CON1.P$2 | 4.02,15.16 4.02,15.17 3.33,15.86 v3.18,15.86 | v8.56,67.45 8.61,67.4 8.56,67.35 v8.56,65.45 | 10.22,66.77 10.21,66.76 10.56,66.41 | 10.56,66.41 v10.56,65.45 10.56,65.3 10.53,65.27 11.42,64.38 13.31,64.38 12.56,65.13 v12.56,65.45 | 10.18,66.81 10.18,66.9 10.61,67.33 10.56,67.38 v10.56,67.45 12.44,67.45 12.56,67.33 | 12.56,67.33 12.6,67.29 | 12.56,67.33 v12.56,67.45 | 15.68,66.2 15.68,66.15 14.56,67.27 v14.56,67.45 | 15.45,66.15 15.55,66.05 | v14.56,65.45 14.95,65.45 15.55,66.05 | 15.55,66.05 15.58,66.05 16.18,65.45 v16.56,65.45 | 15.74,66.2 15.74,66.43 16.56,67.25 v16.56,67.45 | 10.56,66.41 10.56,63.82 10.74,63.64 v10.56,63.46 v10.56,63.45 10.56,61.73 10.63,61.66 10.56,61.59 v10.56,61.45 | 10.73,59.45 v10.56,59.45 | v8.56,59.45 10.73,59.45 | 10.73,59.45 10.78,59.4 | v12.56,59.45 12.56,61.24 12.68,61.36 12.59,61.45 v12.56,61.45 12.56,62.34 13.04,62.82 12.97,62.82 | 14.62,62.79 14.62,62.8 14.56,62.86 v14.56,63.45 | 15.04,62.45 15.04,62.44 14.73,62.13 14.73,61.76 14.77,61.72 14.79,61.72 14.62,61.55 14.62,61.34 14.56,61.4 v14.56,61.45 14.56,61.22 14.73,61.05 14.56,60.88 v14.56,59.45 16.23,59.45 16.43,59.25 16.56,59.38 v16.56,59.45